# Altium schematic sheet Channel2.SchDoc
size A3
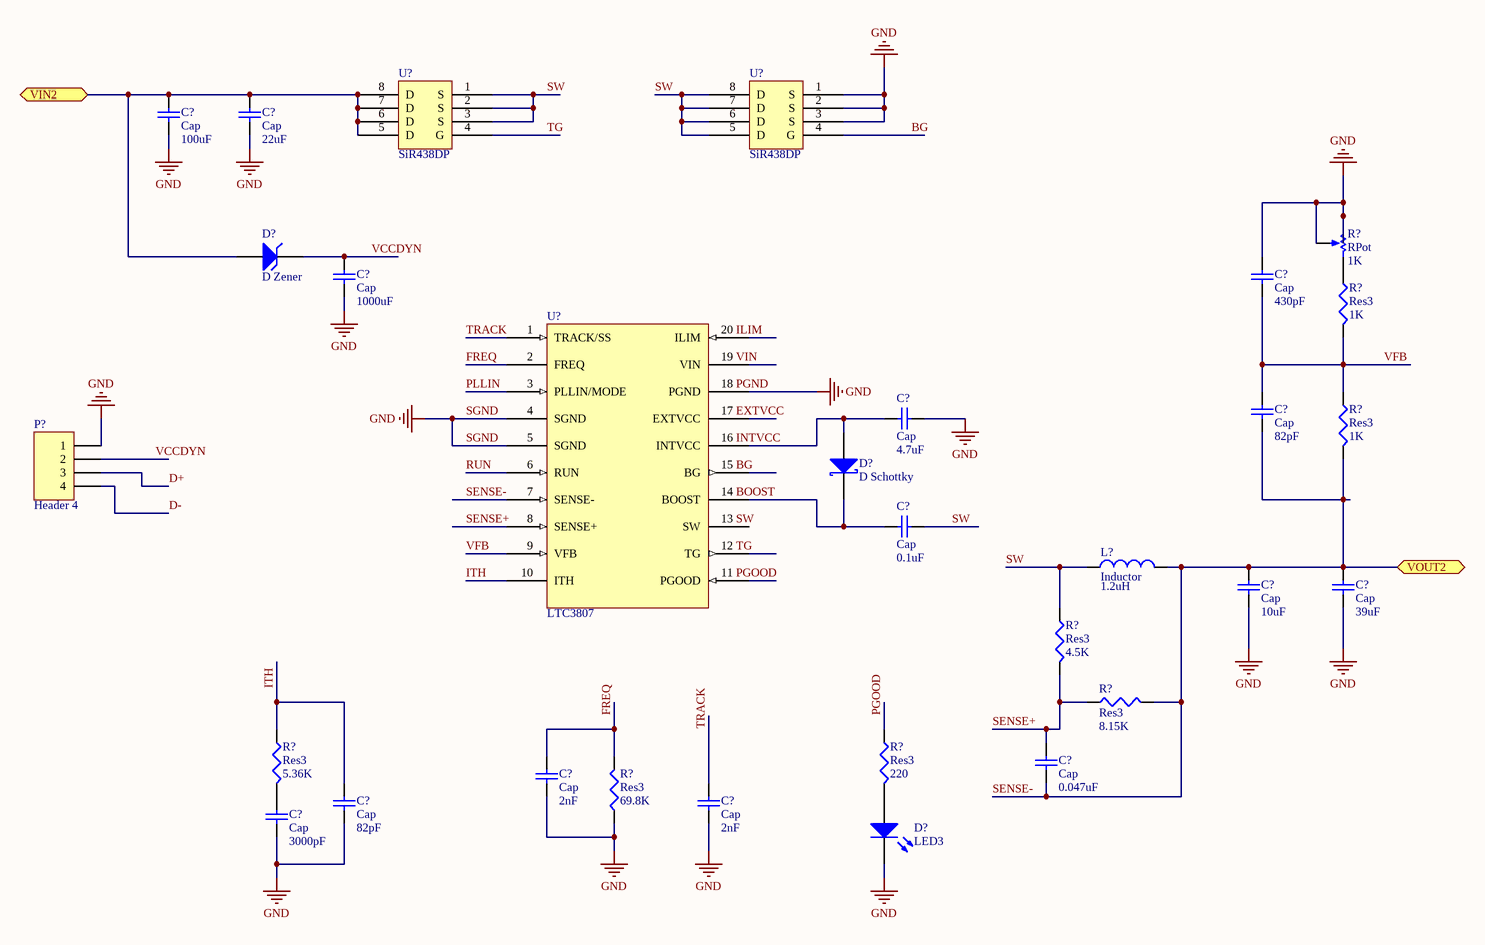
[diagram p0: Channel2.SchDoc]

## Parts
(Parts that share a designator on the sheet are numbered #1, #2 ... from top to bottom, then left to right.)
C?#1  Cap  value 100uF  [1608[0603]]
C?#2  Cap  value 22uF  [1608[0603]]
C?#3  Cap  value 1000uF  [1608[0603]]
C?#4  Cap  value 430pF  [1608[0603]]
C?#5  Cap  value 82pF  [1608[0603]]
C?#6  Cap  value 4.7uF  [1608[0603]]
C?#7  Cap  value 0.1uF  [1608[0603]]
C?#8  Cap  value 10uF  [1608[0603]]
C?#9  Cap  value 39uF  [1608[0603]]
C?#10  Cap  value 0.047uF  [1608[0603]]
C?#11  Cap  value 2nF  [1608[0603]]
C?#12  Cap  value 3000pF  [1608[0603]]
C?#13  Cap  value 82pF  [1608[0603]]
C?#14  Cap  value 2nF  [J1-0603]
D?#1  D Zener  [SMB]
D?#2  D Schottky  [SMB]
D?#3  LED3  [3.5X2.8X1.9]
L?  Inductor  value 1.2uH  [INDM135125X35N]
P?  Header 4  [HDR1X4]
R?#1  RPot  value 1K  [VR5]
R?#2  Res3  value 1K  [J1-0603]
R?#3  Res3  value 1K  [J1-0603]
R?#4  Res3  value 4.5K  [J1-0603]
R?#5  Res3  value 8.15K  [J1-0603]
R?#6  Res3  value 220  [J1-0603]
R?#7  Res3  value 5.36K  [J1-0603]
R?#8  Res3  value 69.8K  [J1-0603]
U?#1  SiR438DP  [SO-8-POWERPAK]
U?#2  SiR438DP  [SO-8-POWERPAK]
U?#3  LTC3807  [TSOP65P660X120_HS-21N]

## Ports
VIN2, VOUT2

## Nets
SGND: C?#1.1 C?#2.1 C?#3.2 C?#4.1 C?#6.1 C?#8.1 C?#9.1 C?#11.1 C?#12.2 C?#13.1 C?#14.1 D?#3.2(K) P?.1 R?#1.2(BOT) R?#1.3(TAP) R?#8.1 U?#2.1(S) U?#2.2(S) U?#2.3(S) U?#3.4(SGND) U?#3.5(SGND) U?#3.18(PGND)  [also labelled GND]
BG: U?#2.4(G)
D+: P?.3
D-: P?.4
FREQ: C?#11.2 R?#8.2 U?#3.2(FREQ)
ITH: C?#13.2 R?#7.2 U?#3.10(ITH)
PGOOD: R?#6.1
PLLIN: U?#3.3(PLLIN/MODE)
RUN: U?#3.6(RUN)
SENSE+: C?#10.1 R?#4.2 R?#5.1 U?#3.8(SENSE+)
SENSE-: C?#5.1 C?#8.2 C?#9.2 C?#10.2 L?.2 R?#3.2 R?#5.2 U?#3.7(SENSE-) ; port VOUT2
SW: C?#7.1 L?.1 R?#4.1 U?#1.1(S) U?#1.2(S) U?#1.3(S) U?#2.5(D) U?#2.6(D) U?#2.7(D) U?#2.8(D)
TG: U?#1.4(G)
TRACK: C?#14.2 U?#3.1(TRACK/SS)
VCCDYN: C?#3.1 D?#1.2(K) P?.2
VFB: C?#4.2 C?#5.2 R?#2.2 R?#3.1 U?#3.9(VFB)
VIN2: C?#1.2 C?#2.2 D?#1.1(A) U?#1.5(D) U?#1.6(D) U?#1.7(D) U?#1.8(D) ; port VIN2
NetC?#6_2: C?#6.2 D?#2.1(A) U?#3.16(INTVCC)
NetC?#7_2: C?#7.2 D?#2.2(K) U?#3.14(BOOST)
NetC?#12_1: C?#12.1 R?#7.1
NetD?#3_1: D?#3.1(A) R?#6.2
NetR?#1_1: R?#1.1(TOP) R?#2.1

Not connected (* = marked no-connect by the designer): U?#3 11(PGOOD) 12(TG) 13(SW) 15(BG) 17(EXTVCC) 19(VIN) 20(ILIM)

## Notes on the sheet
- Labels drawn without touching a wire or pin: BG, BOOST, EXTVCC, ILIM, INTVCC, PGND, PGOOD, SW, TG, VIN

## Library data of the parts
C?#1-C?#14 = Cap: Capacitor; Published: 8-Jun-2000; LatestRevisionDate: 17-Jul-2002; LatestRevisionNote: Re-released for DXP Platform.; PackageReference: RAD-0.3; Publisher: Altium Limited; PackageDescription: Radial Cap, Thru-Hole; 2 Leads; 0.3 in Pin Spacing
D?#1 = D Zener: Zener Diode; Published: 8-Jun-2000; LatestRevisionDate: 17-Jul-2002; LatestRevisionNote: Re-released for DXP Platform.; PackageReference: DIODE-0.7; Publisher: Altium Limited; PackageDescription: Diode, Thru-Hole; 2 Leads; 0.7 in Pin Spacing
D?#2 = D Schottky: Schottky Diode; Published: 8-Jun-2000; LatestRevisionDate: 17-Jul-2002; LatestRevisionNote: Re-released for DXP Platform.; PackageReference: SMB; Publisher: Altium Limited; PackageDescription: DO-214-AA/SMB; 2 C-Bend Leads; Body 5.3 x 3.6 mm, inc. leads (LxW); Code_JEDEC: DO-214-AA
D?#3 = LED3: Typical BLUE SiC LED; Published: 8-Jun-2000; LatestRevisionDate: 17-Dec-2003; LatestRevisionNote: PCB Footprint replaced.; DatasheetVersion: 16-Apr-2002; PackageVersion: 16-Apr-2002; PackageReference: 3.5X2.8X1.9; Publisher: Altium Limited; PackageDescription: SM LED; 2 C-Bend Leads; Body 3.5 x 2.8 x 1.9 mm, inc leads (LxWxH typ)
L? = Inductor: Code_IEC: 1005; Published: 8-Jun-2000; LatestRevisionDate: 29-May-2009; LatestRevisionNote: IPC-7351 Footprint Added.; PackageReference: 0402-A; Publisher: Altium Limited; PackageDescription: Chip Inductor; Code_JEITA: 0402
P? = Header 4: Header, 4-Pin; LatestRevisionDate: 17-Jul-2002; LatestRevisionNote: Re-released for DXP Platform.; Publisher: Altium Limited
R?#1 = RPot: Potentiometer; Sim Note: Enter the Resistance value and the set point into parameter fields.; Set Position: 0.5; Published: 8-Jun-2000; LatestRevisionDate: 17-Jul-2002; LatestRevisionNote: Re-released for DXP Platform.; PackageReference: VR5; Publisher: Altium Limited; PackageDescription: Variable Resistor, Thru-Hole; 3 Leads
R?#2-R?#8 = Res3: Resistor; Published: 8-Jun-2000; LatestRevisionDate: 29-May-2009; LatestRevisionNote: IPC-7351 Footprint Added.; PackageReference: J1-0603; Publisher: Altium Limited; PackageDescription: Chip Resistor
U?#3 = Component_1